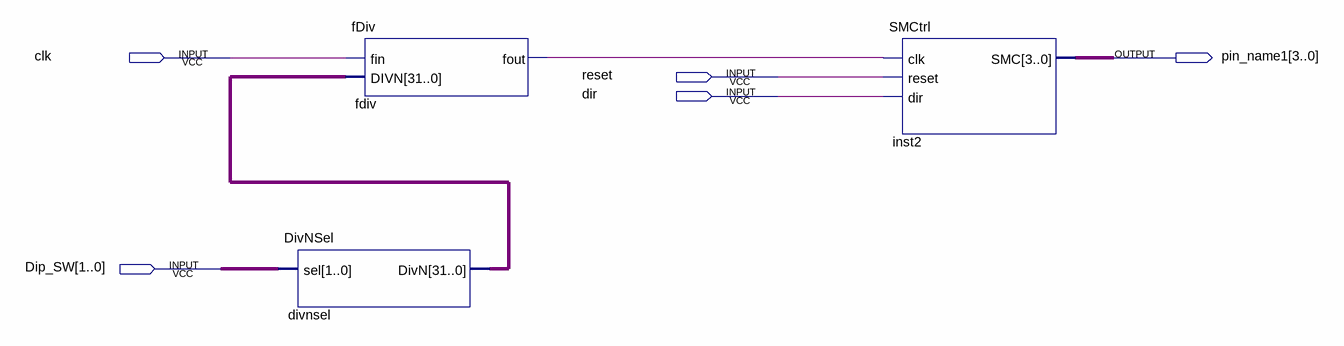
[diagram p0: schematic sheet]
// Quartus schematic week3.bdf as structural Verilog: 3 symbols, 5 pins
module week3 (
  input  clk,
  input  reset,
  input  dir,
  input  [1:0] Dip_SW,
  output [3:0] pin_name1
);

  wire fdiv_fout;
  wire [31:0] divnsel_divn;

  fDiv fdiv (.fin(clk), .DIVN(divnsel_divn), .fout(fdiv_fout));
  DivNSel divnsel (.sel(Dip_SW), .DivN(divnsel_divn));
  SMCtrl inst2 (.clk(fdiv_fout), .reset(reset), .dir(dir), .SMC(pin_name1));
endmodule
